# EAGLE design MainBoard_V0.5 (EAGLE 9.2.2)
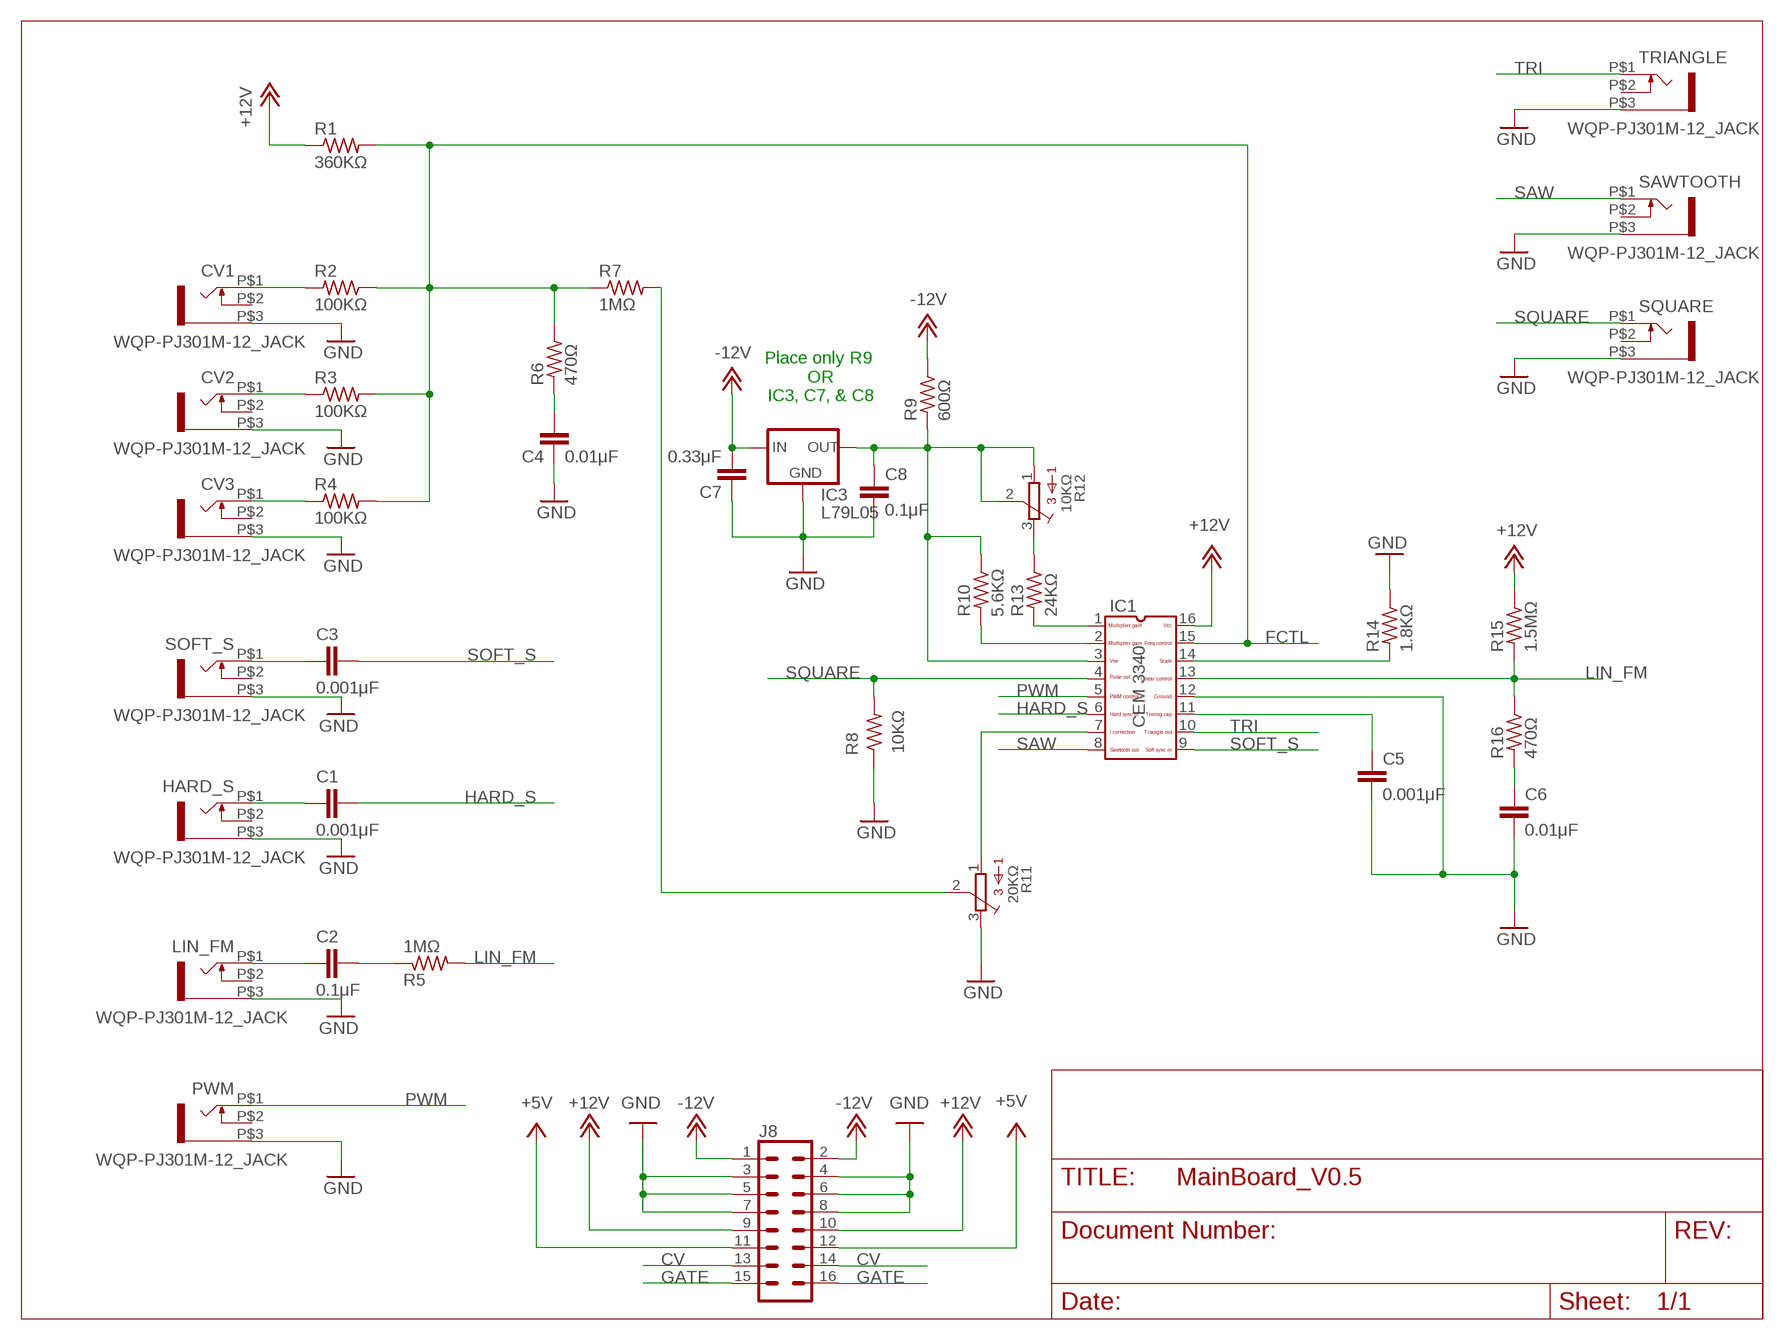
[diagram p0: schematic, sheet 1]

## Parts
C1  0.001μF  C-EU050-025X075  [C050-025X075]
C2  0.1μF  C-EU050-025X075  [C050-025X075]
C3  0.001μF  C-EU050-025X075  [C050-025X075]
C4  0.01μF  C-EU050-025X075  [C050-025X075]
C5  0.001μF  C-EU050-025X075  [C050-025X075]
C6  0.01μF  C-EU050-025X075  [C050-025X075]
C7  0.33μF  C-EU050-025X075  [C050-025X075]
C8  0.1μF  C-EU050-025X075  [C050-025X075]
CV1  WQP-PJ301M-12_JACK  [WQP-PJ301M-12_JACK]
CV2  WQP-PJ301M-12_JACK  [WQP-PJ301M-12_JACK]
CV3  WQP-PJ301M-12_JACK  [WQP-PJ301M-12_JACK]
HARD_S  WQP-PJ301M-12_JACK  [WQP-PJ301M-12_JACK]
IC1  CEM3340  [DIL16]
IC3  L79L05  V_REG_79LXX  [TO-92]
J8  CONN_08X2_SHROUD  [2X8-SHROUDED_LOCK]
LIN_FM  WQP-PJ301M-12_JACK  [WQP-PJ301M-12_JACK]
PWM  WQP-PJ301M-12_JACK  [WQP-PJ301M-12_JACK]
R1  360KΩ  R-US_0207/10  [0207/10]
R2  100KΩ  R-US_0207/10  [0207/10]
R3  100KΩ  R-US_0207/10  [0207/10]
R4  100KΩ  R-US_0207/10  [0207/10]
R5  1MΩ  R-US_0207/10  [0207/10]
R6  470Ω  R-US_0207/10  [0207/10]
R7  1MΩ  R-US_0207/10  [0207/10]
R8  10KΩ  R-US_0207/10  [0207/10]
R9  600Ω  R-US_0207/10  [0207/10]
R10  5.6KΩ  R-US_0207/10  [0207/10]
R11  20KΩ  3386-W  [3386W]
R12  10KΩ  3386-W  [3386W]
R13  24KΩ  R-US_0207/10  [0207/10]
R14  1.8KΩ  R-US_0207/10  [0207/10]
R15  1.5MΩ  R-US_0207/10  [0207/10]
R16  470Ω  R-US_0207/10  [0207/10]
SAWTOOTH  WQP-PJ301M-12_JACK  [WQP-PJ301M-12_JACK]
SOFT_S  WQP-PJ301M-12_JACK  [WQP-PJ301M-12_JACK]
SQUARE  WQP-PJ301M-12_JACK  [WQP-PJ301M-12_JACK]
TRIANGLE  WQP-PJ301M-12_JACK  [WQP-PJ301M-12_JACK]

## Nets
+5V: J8.11 J8.12
+12V: IC1.16 J8.9 J8.10 R1.1 R15.1
-12V: C7.2 IC3.2(IN) J8.1 J8.2 R9.1
CV: J8.13 J8.14
FCTL: IC1.15 R1.2 R2.1 R3.2 R4.2 R6.1 R7.1
GATE: J8.15 J8.16
GND: C4.2 C5.2 C6.2 C7.1 C8.2 CV1.P$3 CV2.P$3 CV3.P$3 HARD_S.P$3 IC1.12 IC3.1(GND) J8.3 J8.4 J8.5 J8.6 J8.7 J8.8 LIN_FM.P$3 PWM.P$3 R8.1 R11.3 R14.1 SAWTOOTH.P$3 SOFT_S.P$3 SQUARE.P$3 TRIANGLE.P$3
HARD_S: C1.2 IC1.6
LIN_FM: IC1.13 R5.2 R15.2 R16.1
N$1: IC1.2 R10.2
N$2: C4.1 R6.2
N$3: IC1.14 R14.2
N$4: C2.1 LIN_FM.P$1
N$5: C2.2 R5.1
N$6: C6.1 R16.2
N$7: C5.1 IC1.11
N$8: IC1.1 R13.2
N$10: R7.2 R11.2
N$11: R12.3 R13.1
N$13: IC1.7 R11.1
N$14: CV1.P$1 R2.2
N$15: C8.1 IC1.3 IC3.3(OUT) R9.2 R10.1 R12.1 R12.2
N$16: C1.1 HARD_S.P$1
N$20: CV2.P$1 R3.1
N$22: CV3.P$1 R4.1
N$29: C3.2 SOFT_S.P$1
PWM: IC1.5 PWM.P$1
SAW: IC1.8 SAWTOOTH.P$1
SOFT_S: C3.1 IC1.9
SQUARE: IC1.4 R8.2 SQUARE.P$1
TRI: IC1.10 TRIANGLE.P$1
Unconnected: CV1.P$2 CV2.P$2 CV3.P$2 HARD_S.P$2 LIN_FM.P$2 PWM.P$2 SAWTOOTH.P$2 SOFT_S.P$2 SQUARE.P$2 TRIANGLE.P$2

## Notes on the sheet
- Place only R9 
  OR
  IC3, C7, & C8

## Library data of the parts
C1-C8 = rcl:C-EU: CAPACITOR, European symbol; SPICEPREFIX: C
CV1-CV3 HARD_S LIN_FM PWM SAWTOOTH SOFT_S SQUARE TRIANGLE = thonkiconn:WQP-PJ301M-12_JACK
IC1 = CEM:CEM3340: CEM 3340 VCO
IC3 = SparkFun-IC-Power:V_REG_79LXX
J8 = SparkFun-Connectors:CONN_08X2: Multi connection point. Often used as Generic Header-pin footprint for 0.1 inch spaced/style header connections You can populate with any combo of single row headers, but if you'd like an exact match, check this: Header - 2x8 (Male, 0.1") <https://www.sparkfun.com/products/13156> (PRT-13156) On any of the 0.1 inch spaced packages, you can populate with these: Break Away Headers - Straight <https://www.sparkfun.com/products/116> (PRT-00116) Break Away Male Headers - Right Angle <https://www.sparkfun.com/products/553> (PRT-00553) Female Headers <https://www.sparkfun.com/products/115> (PRT-00115) Break Away Headers - Machine Pin <https://www.sparkfun.com/products/117> (PRT-00117) Break Away Female Headers - Swiss Machine Pin <https://www.sparkfun.com/products/743> (PRT-00743)
R1-R10 R13-R16 = rcl:R-US_: RESISTOR, American symbol; SPICEPREFIX: R
R11 R12 = bourns:3386-: 3386 Series 3/8" Square Trimmer

## Net classes
0 default: width 0.61 mm, drill 0.254 mm, clearance 0.305 mm

## Board
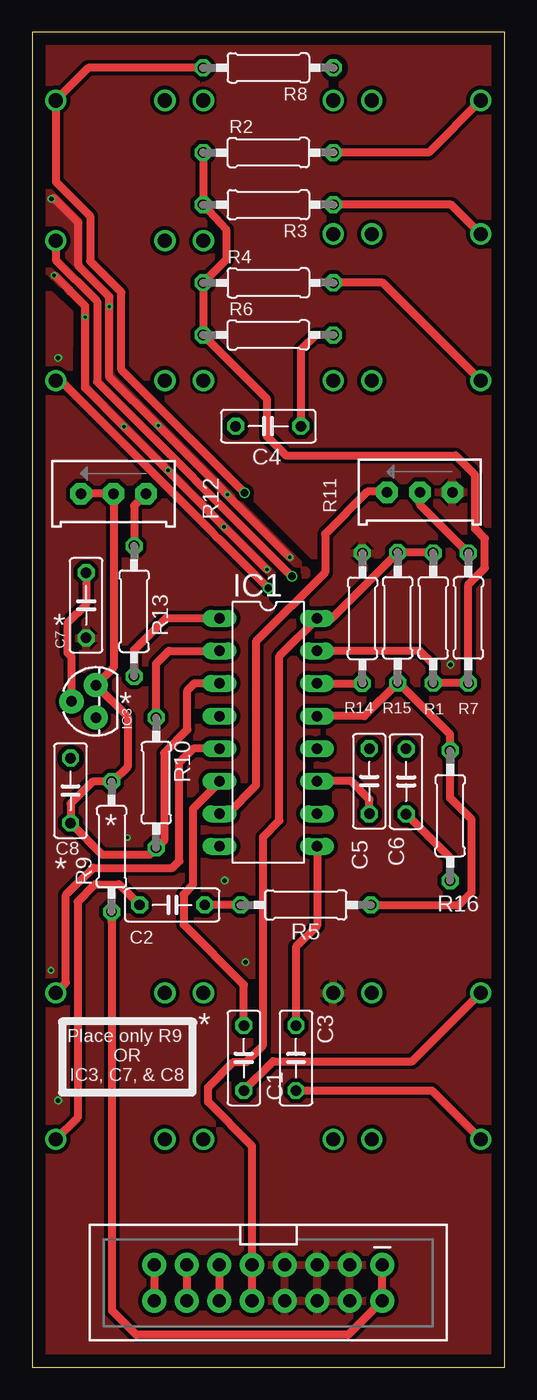
[diagram p1: board, top side]
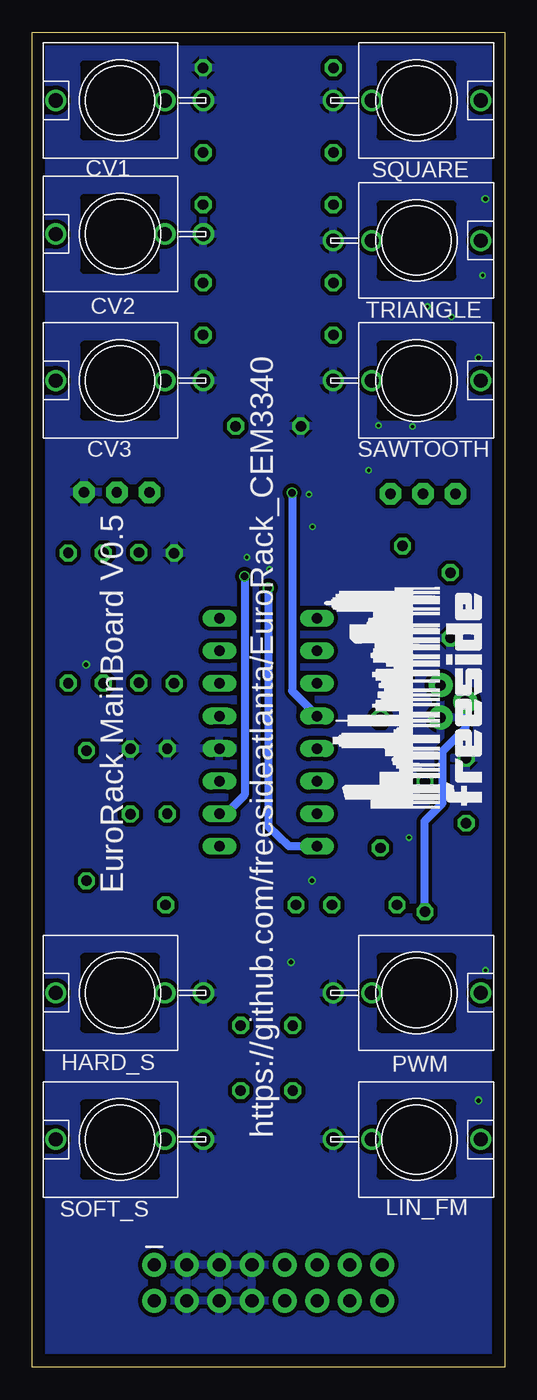
[diagram p2: board, bottom side, seen from below]

Size 36.83 x 104.14 mm. Coordinates in mm from the lower left corner, seen from the top.
Outline: 0,0 36.83,0 36.83,104.14 0,104.14 0,0
Copper layers (1*16): Top 0.035mm / dielectric 1.5mm / Bottom 0.035mm
Design rules "default *": minimum track width 6mil, minimum drill 10mil, track to track 6mil, track to pad 6mil, pad to pad 6mil, via to via 6mil, smd to smd 6mil, copper to edge 40mil, drill to drill 6mil, minimum pad ring 10mil, minimum via ring 5mil, stop-mask expansion 4mil, vias tented up to drill 0mil, thermal gap 10mil
tRestrict: area 22.7,17 to 24.2,18.5; area 12.6,17 to 14.1,18.5; area 12.6,28.5 to 14.1,30; area 15.1,72.6 to 16.6,74.1; area 12.6,76.2 to 14.1,77.7; area 22.7,76.2 to 24.3,77.7; area 12.6,87.1 to 14.1,88.6; area 22.7,87.6 to 24.2,89.1; area 12.6,98.1 to 14.1,99.6; area 22.7,98.1 to 24.2,99.6; area 22.8,100.6 to 24.3,102.1; area 25.5,47.5 to 27,49; 5 more areas; 5 lines

### Footprints (pad centres in the part's own frame; a part is rotated, then mirrored left to right if it is on the bottom)
C050-025X075 = drill 0.813 octagon: 1 -2.54,0; 2 2.54,0
WQP-PJ301M-12_JACK = drill 1.1: P$1 0,5; P$2 0,-3.5; P$3 0,-6.5
DIL16 = drill 0.813 long: 1 -8.89,-3.81; 2 -6.35,-3.81; 3 -3.81,-3.81; 4 -1.27,-3.81; 5 1.27,-3.81; 6 3.81,-3.81; 7 6.35,-3.81; 8 8.89,-3.81; 9 8.89,3.81; 10 6.35,3.81; 11 3.81,3.81; 12 1.27,3.81; 13 -1.27,3.81; 14 -3.81,3.81; 15 -6.35,3.81; 16 -8.89,3.81
TO-92 = drill 0.813 pad 1.88: 1 -1.27,0; 2 0,1.905; 3 1.27,0
2X8-SHROUDED_LOCK = drill 1.016 pad 1.88: 1 -1.397,8.89; 2 1.397,8.89; 3 -1.397,6.35; 4 1.397,6.35; 5 -1.397,3.81; 6 1.397,3.81; 7 -1.397,1.27; 8 1.397,1.27; 9 -1.397,-1.27; 10 1.397,-1.27; 11 -1.397,-3.81; 12 1.397,-3.81; 13 -1.397,-6.35; 14 1.397,-6.35; 15 -1.397,-8.89; 16 1.397,-8.89
0207/10 = drill 0.813 octagon: 1 -5.08,0; 2 5.08,0
3386W = drill 0.813 pad 1.676 octagon: 1 2.54,0.318; 2 0,0.318; 3 -2.54,0.318

### Placement (x,y rotation side)
C1  16.51,24.13 90 top
C2  10.92,36.07 0 top
C3  20.57,24.13 270 top
C4  18.41,73.41 180 top
C5  26.29,45.72 90 top
C6  29.16,45.69 90 top
C7  4.22,59.44 90 top
C8  3,44.98 90 top
CV1  29.97,98.81 90 bottom
CV2  29.97,88.39 90 bottom
CV3  29.97,76.96 90 bottom
HARD_S  29.97,29.21 90 bottom
IC1  18.41,49.53 270 top
IC3  4.98,51.94 90 top
J8  18.41,6.6 270 top
LIN_FM  6.86,17.78 270 bottom
PWM  6.86,29.21 270 bottom
R1  31.27,58.45 270 top
R2  18.41,94.74 0 top
R3  18.41,90.68 180 top
R4  18.41,84.58 180 top
R5  21.34,36.07 0 top
R6  18.41,80.52 0 top
R7  34.01,58.45 90 top
R8  18.41,101.35 180 top
R9  6.2,40.61 90 top
R10  9.68,45.59 90 top
R11  30.23,68.58 180 top
R12  6.35,68.45 180 top
R13  7.95,58.98 270 top
R14  25.76,58.42 270 top
R15  28.5,58.47 270 top
R16  32.59,43.03 270 top
SAWTOOTH  6.86,76.96 270 bottom
SOFT_S  29.97,17.78 90 bottom
SQUARE  6.86,98.81 270 bottom
TRIANGLE  6.86,87.88 270 bottom

### Tracks (layer width: path | path; a pad name or v marks a point on that pad's centre or on a via)
+5V
  Top 0.61: J8.11 J8.12
+12V
  Top 0.61: R1.1 31.24,63.55 R15.1 23.37,58.42 IC1.16 19.28,55.47 19.28,42.65 18.01,41.38 18.01,25.12 16.71,23.82 15.7,23.82 13.72,21.84 13.72,20.7 17.14,17.27 J8.9 J8.10
-12V
  Top 0.61: J8.1 J8.2 24.64,2.54 8.13,2.54 6.22,4.45 6.22,34.72 6.2,34.75 R9.1 | IC3.2 3.07,55.42 2.74,55.75 2.74,58.04 4.22,59.51 C7.2
  Bottom 0.61: R9.1 6.25,35.59 6.25,42.6 4.85,43.99 4.85,48.03 3.07,49.81 IC3.2
CV
  Top 0.61: J8.13 J8.14
FCTL
  Top 0.61: IC1.15 30.23,55.88 31.27,54.84 R1.2 R7.1 34.01,61.06 35.31,62.36 35.31,64.64 34.54,65.41 34.54,69.6 33.02,71.12 19.81,71.12 18.29,72.64 18.29,75.56 R6.1 R4.2 15.12,86.38 15.12,88.73 R3.2 R2.1
GATE
  Top 0.61: J8.15 J8.16
GND  (via drill 0.25, 0.25 pad 0.51, 0.35)
  Top 0.61: v18.31,62.23 v14.96,65.56 v7.16,73.38 4.14,76.4 v4.14,81.92 4.14,82.78 1.76,85.17 | v20.09,63.17 9.83,73.43 v9.83,73.46 6.02,77.22 v6.02,82.73 6.02,83.49 3.61,85.9 3.61,89.26 1.68,91.19
  other vias: 1.7,85.17 1.5,91.14 10.59,69.95 15.24,68.07 32.61,54.81 16.64,31.6 15.01,37.97 2.03,20.83 2.03,78.74 7.44,41.33 1.47,30.96
  pour Bottom (isolate 0.305): 0,104.14 37.08,104.14 37.08,0 0,0
  pour Top: 0,104.14 37.08,104.14 37.08,0 0,0
HARD_S
  Top 0.61: IC1.6 14.61,45.64 12.54,43.57 12.54,37.63 11.81,36.91 11.81,34.54 16.51,29.84 C1.2
LIN_FM
  Top 0.61: R5.2 26.47,36.02 33.24,36.02 34.27,37.04 34.27,42.72 32.59,44.4 R16.1 32.59,49.38 28.57,53.39 R15.2 25.91,50.8 IC1.13
N$1
  Top 0.61: R10.2 9.68,54.89 10.67,55.88 IC1.2
N$2
  Top 0.61: R6.2 22.1,80.52 20.95,79.38 C4.1
N$3
  Top 0.61: IC1.14 R14.2
N$4
  Top 0.61: LIN_FM.P$1 3.56,19.48 3.56,36.32 4.9,37.67 6.78,37.67 C2.1 7.11,37.34
N$5
  Top 0.61: R5.1 C2.2
N$6
  Top 0.61: R16.2 32.59,39.73 C6.1
N$7
  Top 0.61: C5.1 26.29,44.3 24.87,45.72 IC1.11
N$8
  Top 0.61: IC1.1 10.41,58.42 7.95,55.96 R13.2
N$10
  Top 0.61: R7.2 30.23,67.31 R11.2
N$11
  Top 0.61: R12.3 7.95,67.2 R13.1
N$13
  Top 0.61: IC1.7 15.24,43.18 17.45,45.39 17.45,56.6 22.84,61.99 22.84,65 26.14,68.3 27.65,68.3 R11.1
N$14
  Top 0.61: CV1.P$1 30.91,94.74 R2.2
N$15
  Top 0.61: R12.1 R12.2 6.35,54.59 IC3.3 7.44,50.75 7.44,46.84 6.3,45.7 R9.2 4.72,45.7 3,43.97 C8.1 5.46,39.98 9.14,39.98 R10.1 9.73,40.51 10.3,41.08 10.3,47.92 12.12,49.73 12.12,52.8 12.66,53.34 IC1.3
N$16
  Top 0.61: C1.1 18.8,23.88 29.64,23.88 HARD_S.P$1
N$20
  Top 0.61: CV2.P$1 32.69,90.68 R3.1
N$22
  Top 0.61: CV3.P$1 27.35,84.58 R4.1
N$29
  Top 0.61: C3.2 31.16,21.59 SOFT_S.P$1
PWM
  Top 0.61: IC1.5 12.57,48.26 11.48,47.17 11.48,39.5 10.95,38.96 4.78,38.96 2.64,36.83 2.64,29.99 PWM.P$1
SAW  (via drill 0.56)
  Top 0.61: SAWTOOTH.P$1 2.24,76.96 14.02,65.18 14.02,65.17 14.57,64.62 14.58,64.62 v18.41,60.79
  Bottom 0.61: v18.41,60.79 18.41,42.19 16.79,40.64 IC1.8
SOFT_S
  Top 0.61: IC1.9 22.23,34.44 20.57,32.79 C3.1
SQUARE  (via drill 0.56)
  Top 0.61: R8.2 4.4,101.35 SQUARE.P$1 1.86,92.45 4.52,89.79 4.52,86.28 6.96,83.84 6.96,77.8 v16.56,68.2
  Bottom 0.61: v16.56,68.2 16.56,52.76 IC1.4
TRI  (via drill 0.56)
  Top 0.61: TRIANGLE.P$1 1.86,86.36 5.08,83.14 5.08,76.86 20.24,61.7 v20.27,61.7
  Bottom 0.61: v20.27,61.7 20.27,44.63 21.72,43.18 IC1.10

### Text on the board
tPlace: * | * | * | * | * | Place only R9 / OR / IC3, C7, & C8
bPlace: https://github.com/freesideatlanta/EuroRack_CEM3340 | EuroRack MainBoard V0.5